# EAGLE design mixer_module (EAGLE 6.1)
AUTH: Jeremy Ruhland; LAST_DATE_TIME: 4/29/2014; VER: 1.0
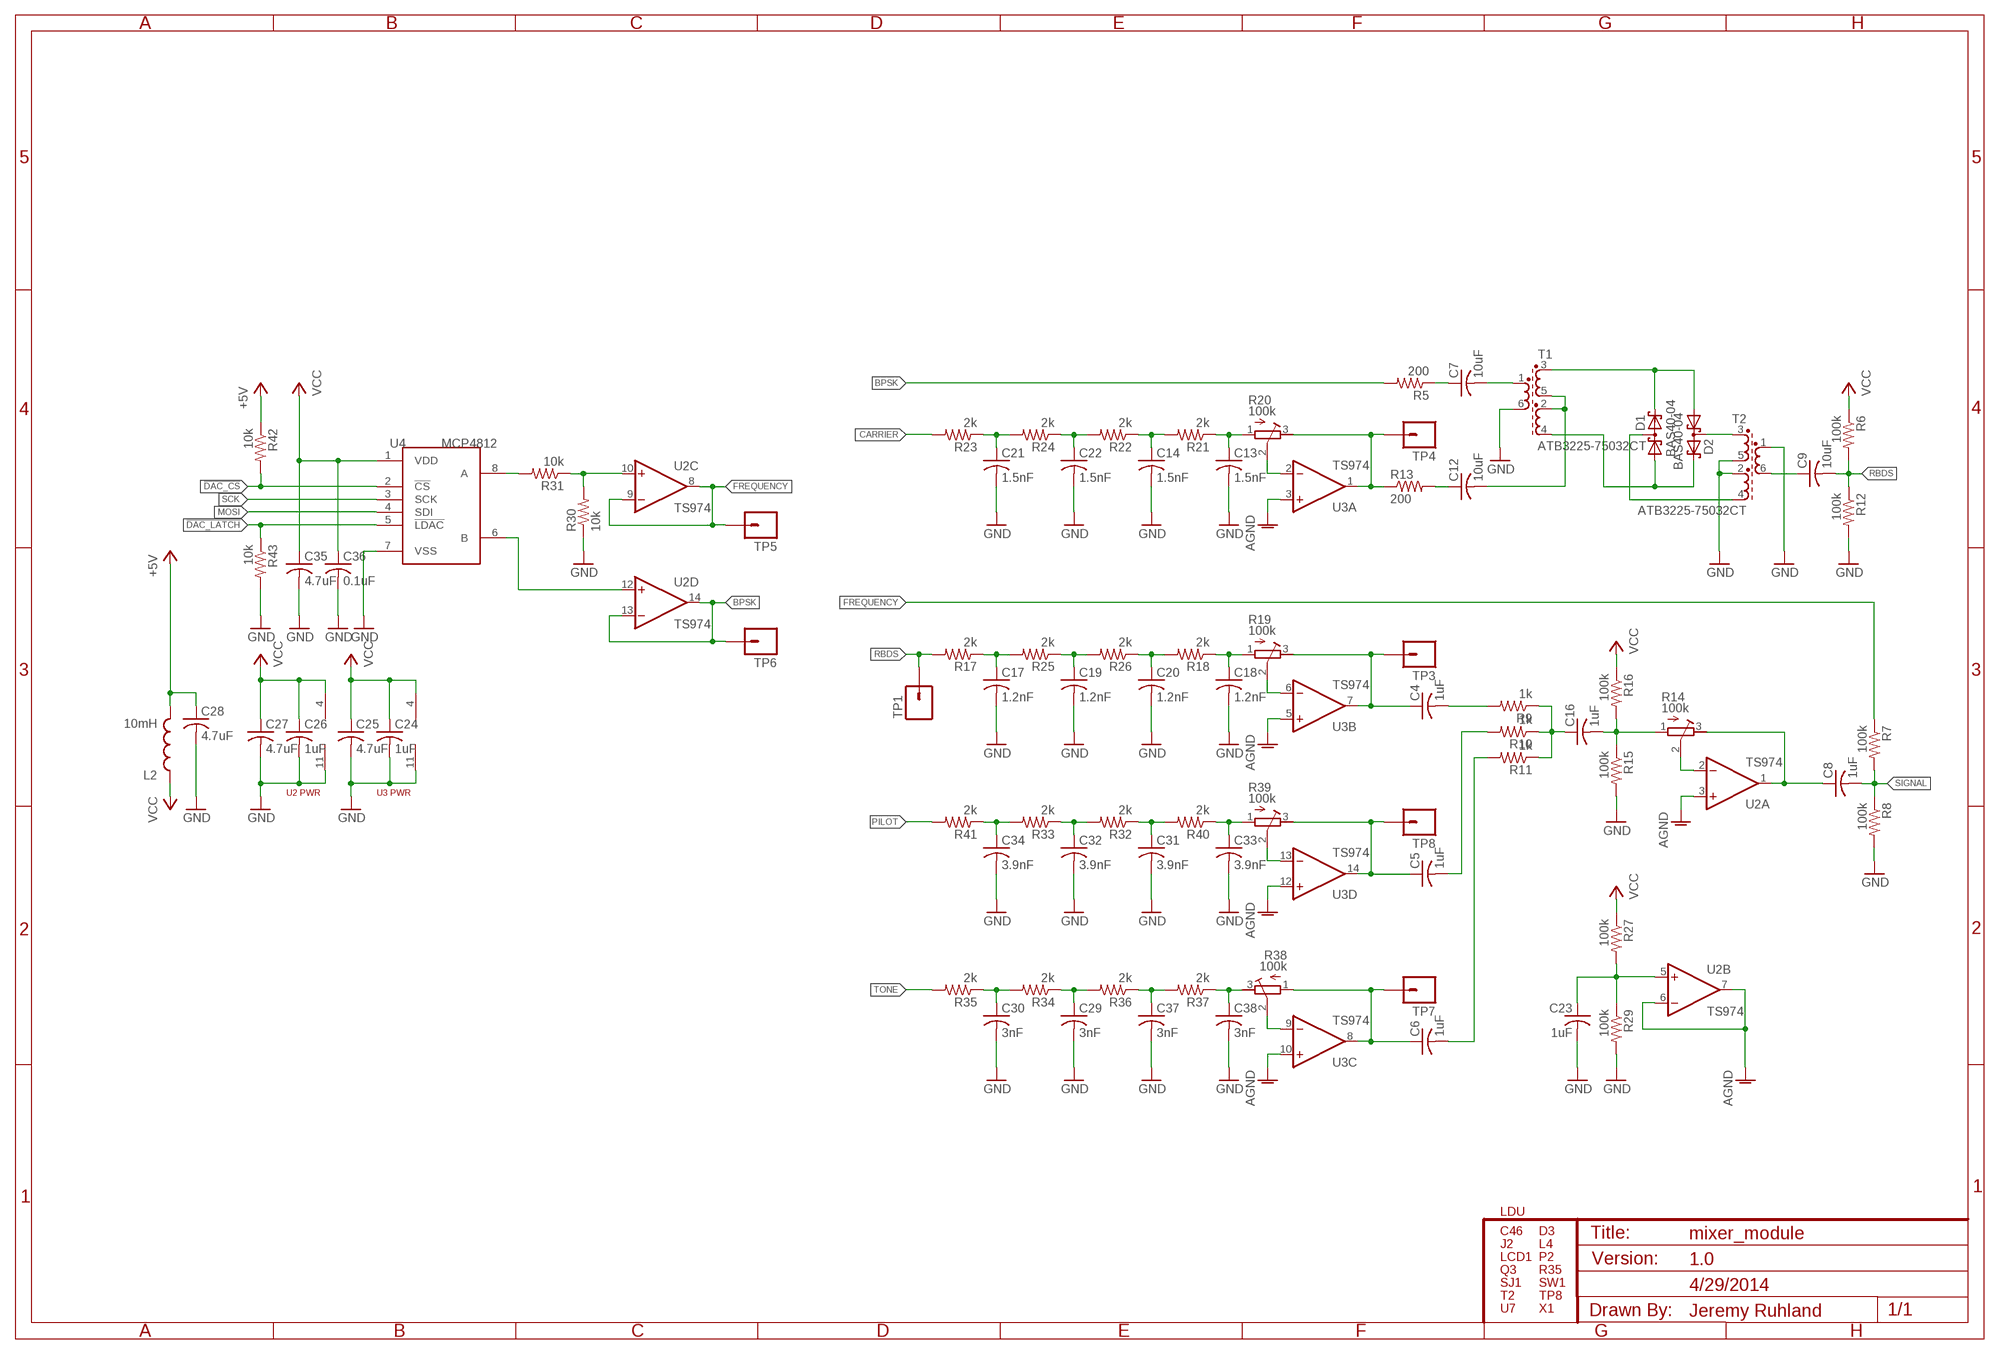
[diagram p0: schematic, sheet 1]

## Parts
C4  1uF  C-USC1206  [C1206]
C5  1uF  C-USC1206  [C1206]
C6  1uF  C-USC1206  [C1206]
C7  10uF  C-USC1206  [C1206]
C8  1uF  C-USC1206  [C1206]
C9  10uF  C-USC1206  [C1206]
C12  10uF  C-USC1206  [C1206]
C13  1.5nF  C-USC1206  [C1206]
C14  1.5nF  C-USC1206  [C1206]
C16  1uF  C-USC1206  [C1206]
C17  1.2nF  C-USC1206  [C1206]
C18  1.2nF  C-USC1206  [C1206]
C19  1.2nF  C-USC1206  [C1206]
C20  1.2nF  C-USC1206  [C1206]
C21  1.5nF  C-USC1206  [C1206]
C22  1.5nF  C-USC1206  [C1206]
C23  1uF  C-USC1206  [C1206]
C24  1uF  C-USC1206  [C1206]
C25  4.7uF  C-USC1206  [C1206]
C26  1uF  C-USC1206  [C1206]
C27  4.7uF  C-USC1206  [C1206]
C28  4.7uF  C-USC1206  [C1206]
C29  3nF  C-USC1206  [C1206]
C30  3nF  C-USC1206  [C1206]
C31  3.9nF  C-USC1206  [C1206]
C32  3.9nF  C-USC1206  [C1206]
C33  3.9nF  C-USC1206  [C1206]
C34  3.9nF  C-USC1206  [C1206]
C35  4.7uF  C-USC1206  [C1206]
C36  0.1uF  C-USC1206  [C1206]
C37  3nF  C-USC1206  [C1206]
C38  3nF  C-USC1206  [C1206]
D1  BAS40-04  [SOT23]
D2  BAS40-04  [SOT23]
L2  10mH  INDUCTOR1210  [1210]
R5  200  R-US_R1206  [R1206]
R6  100k  R-US_R1206  [R1206]
R7  100k  R-US_R1206  [R1206]
R8  100k  R-US_R1206  [R1206]
R9  1k  R-US_R1206  [R1206]
R10  1k  R-US_R1206  [R1206]
R11  1k  R-US_R1206  [R1206]
R12  100k  R-US_R1206  [R1206]
R13  200  R-US_R1206  [R1206]
R14  100k  R-TRIMM3304W  [RTRIM3304W]
R15  100k  R-US_R1206  [R1206]
R16  100k  R-US_R1206  [R1206]
R17  2k  R-US_R1206  [R1206]
R18  2k  R-US_R1206  [R1206]
R19  100k  R-TRIMM3304W  [RTRIM3304W]
R20  100k  R-TRIMM3304W  [RTRIM3304W]
R21  2k  R-US_R1206  [R1206]
R22  2k  R-US_R1206  [R1206]
R23  2k  R-US_R1206  [R1206]
R24  2k  R-US_R1206  [R1206]
R25  2k  R-US_R1206  [R1206]
R26  2k  R-US_R1206  [R1206]
R27  100k  R-US_R1206  [R1206]
R29  100k  R-US_R1206  [R1206]
R30  10k  R-US_R1206  [R1206]
R31  10k  R-US_R1206  [R1206]
R32  2k  R-US_R1206  [R1206]
R33  2k  R-US_R1206  [R1206]
R34  2k  R-US_R1206  [R1206]
R35  2k  R-US_R1206  [R1206]
R36  2k  R-US_R1206  [R1206]
R37  2k  R-US_R1206  [R1206]
R38  100k  R-TRIMM3304W  [RTRIM3304W]
R39  100k  R-TRIMM3304W  [RTRIM3304W]
R40  2k  R-US_R1206  [R1206]
R41  2k  R-US_R1206  [R1206]
R42  10k  R-US_R1206  [R1206]
R43  10k  R-US_R1206  [R1206]
T1  ATB3225-75032CT  [TRANS]
T2  ATB3225-75032CT  [TRANS]
TP1  M01PTH  [1X01]
TP3  M01PTH  [1X01]
TP4  M01PTH  [1X01]
TP5  M01PTH  [1X01]
TP6  M01PTH  [1X01]
TP7  M01PTH  [1X01]
TP8  M01PTH  [1X01]
U2  TS974  OPA4743UA  [SO14]
U3  TS974  OPA4743UA  [SO14]
U4  MCP4812  [SO-08]

## Nets
!DAC_CS: R42.2 U4.2(!CS)
!DAC_LATCH: R43.1 U4.5(!LDAC)
+5V: C28.1 L2.2 R42.1
AGND: U2.3(A:+IN) U2.6(B:-IN) U2.7(B:OUT) U3.3(A:+IN) U3.5(B:+IN) U3.10(C:+IN) U3.12(D:+IN)
BPSK: R5.2 TP6.1 U2.13(D:-IN) U2.14(D:OUT)
CARRIER: R23.2
FREQUENCY: R7.1 TP5.1 U2.8(C:OUT) U2.9(C:-IN)
GND: C13.2 C14.2 C17.2 C18.2 C19.2 C20.2 C21.2 C22.2 C23.2 C24.2 C25.2 C26.2 C27.2 C28.2 C29.2 C30.2 C31.2 C32.2 C33.2 C34.2 C35.2 C36.2 C37.2 C38.2 R8.2 R12.2 R15.2 R29.2 R30.1 R43.2 T1.6 T2.1 T2.2 T2.5 U2.11(P:V-) U3.11(P:V-) U4.7(VSS)
MOSI: U4.4(SDI)
N$1: C38.1 R37.1 R38.3(E)
N$3: D1.3(C1A2) T2.4
N$5: C16.2 R14.1(A) R15.1 R16.2
N$14: D2.3(C1A2) T2.3
N$16: D1.2(C2) D2.1(A1) T1.3
N$18: D1.1(A1) D2.2(C2) T1.4
N$19: C12.2 T1.2 T1.5
N$20: C7.2 T1.1
N$22: R14.2(S) U2.2(A:-IN)
N$23: C8.1 R14.3(E) U2.1(A:OUT)
N$25: C7.1 R5.1
N$26: C12.1 R13.2
N$27: R31.2 U4.8(A)
N$28: U2.12(D:+IN) U4.6(B)
N$42: C9.1 T2.6
N$46: R30.2 R31.1 U2.10(C:+IN)
N$55: C21.1 R23.1 R24.2
N$59: C22.1 R22.2 R24.1
N$60: C19.1 R25.1 R26.2
N$61: C20.1 R18.2 R26.1
N$62: C18.1 R18.1 R19.1(A)
N$63: C13.1 R20.1(A) R21.1
N$64: R19.2(S) U3.6(B:-IN)
N$65: C4.1 R19.3(E) TP3.1 U3.7(B:OUT)
N$66: C23.1 R27.2 R29.1 U2.5(B:+IN)
N$67: C32.1 R32.2 R33.1
N$68: C31.1 R32.1 R40.2
N$69: C33.1 R39.1(A) R40.1
N$70: R39.2(S) U3.13(D:-IN)
N$71: C5.1 R39.3(E) TP8.1 U3.14(D:OUT)
N$72: C29.1 R34.1 R36.2
N$73: C37.1 R36.1 R37.2
N$74: C6.1 R38.1(A) TP7.1 U3.8(C:OUT)
N$75: R38.2(S) U3.9(C:-IN)
N$77: R20.2(S) U3.2(A:-IN)
N$78: C4.2 R9.2
N$79: C5.2 R10.2
N$80: C6.2 R11.2
N$81: C16.1 R9.1 R10.1 R11.1
N$82: R13.1 R20.3(E) TP4.1 U3.1(A:OUT)
N$83: C17.1 R17.1 R25.2
N$84: C34.1 R33.2 R41.1
N$85: C30.1 R34.2 R35.1
N$86: C14.1 R21.2 R22.1
PILOT: R41.2
RBDS: C9.2 R6.2 R12.1 R17.2 TP1.1
SCK: U4.3(SCK)
SIGNAL: C8.2 R7.2 R8.1
TONE: R35.2
VCC: C24.1 C25.1 C26.1 C27.1 C35.1 C36.1 L2.1 R6.1 R16.1 R27.1 U2.4(P:V+) U3.4(P:V+) U4.1(VDD)

## Notes on the sheet
- U2 PWR | U3 PWR
- LDU
- C46 | D3
- J2 | L4
- LCD1 | P2
- Q3 | R35
- SJ1 | SW1
- T2 | TP8
- U7 | X1

## Library data of the parts
C4-C9 C12-C14 C16-C38 = adafruit:C-US: CAPACITOR, American symbol
D1 D2 = diode:BAS40-04: Silicon Schottky Diodes General-purpose diode for high-speed switching
L2 = sparkfun:INDUCTOR: Inductors Basic Inductor/Choke - 0603 and 1206. Footprints are not proven and vary greatly between part numbers.
R5-R13 R15-R18 R21-R27 R29-R37 R40-R43 = adafruit:R-US_: RESISTOR, American symbol
R14 R19 R20 R38 R39 = rcl:R-TRIMM: Trimm resistor
T1 T2 = tdk:ATB3225-75032CT
TP1 TP3-TP8 = sparkfun:M01: Header 1 Standard 1-pin 0.1" header. Use with straight break away headers (SKU : PRT-00116), right angle break away headers (PRT-00553), swiss pins (PRT-00743), machine pins (PRT-00117), and female headers (PRT-00115).
U2 U3 = linear:OPA4743: 12V, 7MHz, CMOS, Rail-to-Rail I/O Quad OP AMP Source: http://focus.ti.com/lit/ds/sbos201/sbos201.pdf
U4 = microchip:MCP4812

## Board
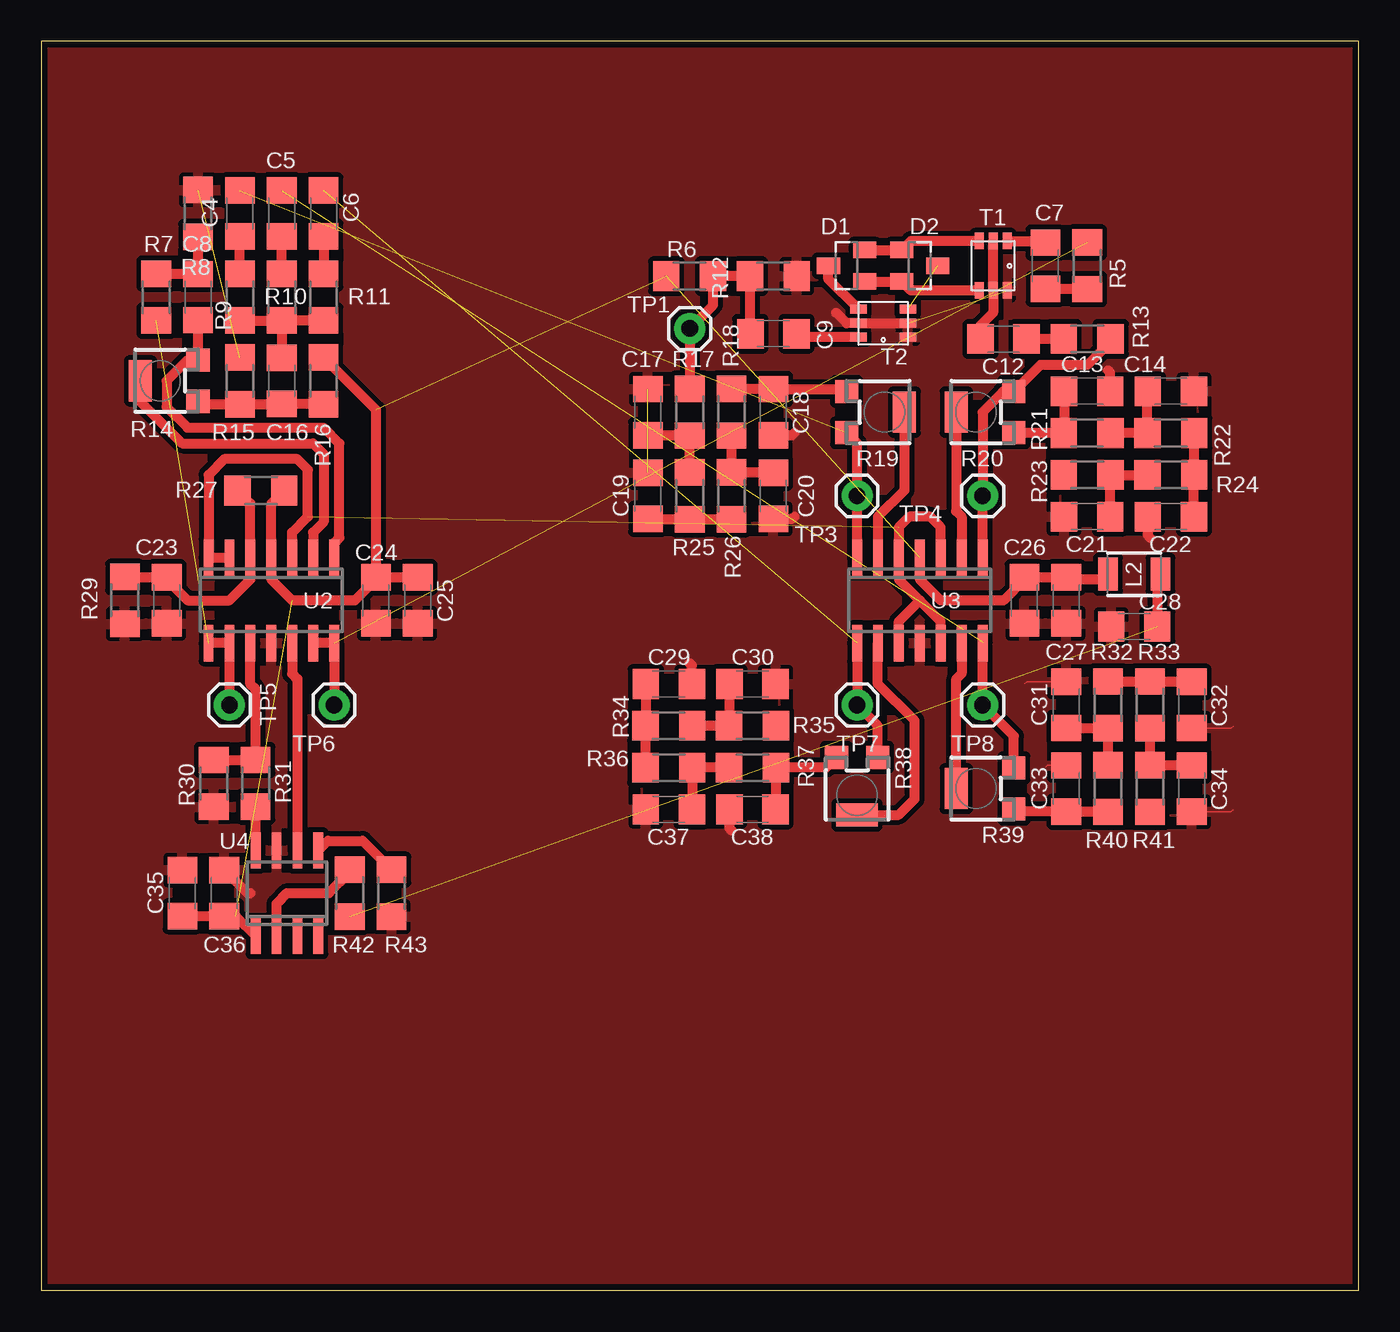
[diagram p1: board, top side]

Size 79.99 x 75.87 mm. Coordinates in mm from the lower left corner, seen from the top.
Outline: 0,0 79.99,0 79.99,75.87 0,75.87 0,0
Copper layers (1*16): Top 0.035559375mm / dielectric 1.501140625mm / Bottom 0.035559375mm
Design rules: minimum track width 10mil, minimum drill 15mil, track to track 6mil, track to pad 6mil, pad to pad 6mil, via to via 6mil, smd to smd 6mil, copper to edge 15mil, drill to drill 8mil, minimum pad ring 10mil, minimum via ring 8mil, stop-mask expansion 4mil, vias tented up to drill 0mil, thermal gap 10mil
tRestrict: area 61.9,29.2 to 70.2,36.5; area 36.8,28.9 to 44.5,37.1; area 36.5,47 to 44.8,54.6; area 62.2,46.7 to 69.8,54.9; area 11.4,53.7 to 17.8,67; area 18.4,22.5 to 21.6,25.7; area 8.3,22.5 to 11.4,25.7; area 10.8,40.3 to 17.8,43.5

### Footprints (pad centres in the part's own frame; a part is rotated, then mirrored left to right if it is on the bottom)
C1206 = smd 1.6 x 1.8: 1 -1.4,0; 2 1.4,0
SOT23 = smd 1 x 1.4: 1 -0.95,-1.1; 2 0.95,-1.1; 3 0,1.1
1210 = smd 1.2 x 2: 1 -1.6,0; 2 1.6,0
R1206 = smd 1.6 x 1.803: 1 -1.422,0; 2 1.422,0
RTRIM3304W = smd 1.4 x 1.4: 1 -1.25,-1.9; 3 1.25,-1.9 | smd 2.5 x 1.4: 2 0,1.6
TRANS = smd 1 x 0.55: 1 -1.5,0.85; 2 -1.5,0; 3 -1.5,-0.85; 4 1.5,-0.85; 5 1.5,0; 6 1.5,0.85
1X01 = drill 1.016 pad 1.88: 1 0,0
SO14 = smd 0.6 x 2.2: 1 -3.81,-2.6; 2 -2.54,-2.6; 3 -1.27,-2.6; 4 0,-2.6; 5 1.27,-2.6; 6 2.54,-2.6; 7 3.81,-2.6; 8 3.81,2.6; 9 2.54,2.6; 10 1.27,2.6; 11 0,2.6; 12 -1.27,2.6; 13 -2.54,2.6; 14 -3.81,2.6
SO-08 = smd 0.6 x 2.2: 1 -1.905,-2.6; 2 -0.635,-2.6; 3 0.635,-2.6; 4 1.905,-2.6; 5 1.905,2.6; 6 0.635,2.6; 7 -0.635,2.6; 8 -1.905,2.6

### Placement (x,y rotation side)
C4  12.06,65.41 270 top
C5  14.61,65.41 270 top
C6  17.14,65.41 270 top
C7  60.96,62.23 90 top
C8  9.53,60.33 90 top
C9  44.45,58.1 180 top
C12  58.42,57.78 180 top
C13  63.5,54.61 0 top
C14  68.58,54.61 0 top
C16  14.61,55.24 270 top
C17  36.83,53.34 90 top
C18  44.45,53.34 270 top
C19  36.83,48.26 90 top
C20  44.45,48.26 270 top
C21  63.5,46.99 180 top
C22  68.58,46.99 180 top
C23  7.62,41.91 270 top
C24  20.32,41.91 270 top
C25  22.86,41.91 270 top
C26  59.69,41.91 270 top
C27  62.23,41.91 270 top
C28  66.36,40.32 180 top
C29  38.1,36.83 0 top
C30  43.18,36.83 0 top
C31  62.23,35.56 90 top
C32  69.85,35.56 270 top
C33  62.23,30.48 90 top
C34  69.85,30.48 270 top
C35  8.57,24.13 90 top
C36  11.11,24.13 90 top
C37  38.1,29.21 180 top
C38  43.18,29.21 180 top
D1  48.9,62.23 90 top
D2  53.34,62.23 270 top
L2  66.36,43.5 0 top
R5  63.5,62.23 90 top
R6  39.37,61.59 0 top
R7  6.99,60.33 90 top
R8  9.53,65.41 90 top
R9  12.06,60.33 90 top
R10  14.61,60.33 90 top
R11  17.14,60.33 90 top
R12  44.45,61.59 0 top
R13  63.5,57.78 180 top
R14  7.62,55.24 90 top
R15  12.06,55.24 90 top
R16  17.14,55.24 270 top
R17  39.37,53.34 90 top
R18  41.91,53.34 270 top
R19  50.8,53.34 270 top
R20  57.15,53.34 90 top
R21  63.5,52.07 0 top
R22  68.58,52.07 0 top
R23  63.5,49.53 180 top
R24  68.58,49.53 180 top
R25  39.37,48.26 90 top
R26  41.91,48.26 270 top
R27  13.34,48.58 180 top
R29  5.08,41.91 270 top
R30  10.48,30.8 90 top
R31  13.02,30.8 270 top
R32  64.77,35.56 90 top
R33  67.31,35.56 270 top
R34  38.1,34.29 0 top
R35  43.18,34.29 0 top
R36  38.1,31.75 180 top
R37  43.18,31.75 180 top
R38  49.53,30.48 180 top
R39  57.15,30.48 90 top
R40  64.77,30.48 90 top
R41  67.31,30.48 270 top
R42  18.73,24.13 90 top
R43  21.27,24.13 270 top
T1  57.78,62.23 270 top
T2  51.12,58.74 180 top
TP1  39.37,58.42 180 top
TP3  49.53,48.26 180 top
TP4  57.15,48.26 180 top
TP5  11.43,35.56 180 top
TP6  17.78,35.56 180 top
TP7  49.53,35.56 180 top
TP8  57.15,35.56 180 top
U2  13.97,41.91 180 top
U3  53.34,41.91 180 top
U4  14.92,24.13 0 top

### Tracks (layer width: path | path; a pad name or v marks a point on that pad's centre or on a via)
!DAC_CS
  Top 0.61: U4.2 14.29,23.5 14.92,24.13 17.46,24.13 18.73,25.4 R42.2
!DAC_LATCH
  Top 0.61: U4.5 17.4,27.3 19.52,27.3 R43.1
+5V  (1 unrouted)
  Top 0.61: L2.2 67.76,43.3 C28.1
AGND  (1 unrouted)
  Top 0.61: U3.3 54.61,46.35 53.98,46.99 52.7,46.99 52.07,46.35 U3.5 52.07,43.18 53.34,41.91 | U2.6 U2.7 10.16,49.53 11.11,50.48 15.56,50.48 16.19,49.85 16.19,46.99 15.24,46.04 U2.3 | U3.12 54.61,40.64 53.34,41.91 | U3.10 52.07,40.64 53.34,41.91
BPSK  (1 unrouted)
  Top 0.61: U2.13 16.51,39.37 16.57,39.31 U2.14 TP6.1
FREQUENCY  (1 unrouted)
  Top 0.61: U2.8 U2.9 TP5.1
GND  (3 unrouted)
  Top 0: C31.2 59.82,36.96 59.69,36.83 | C33.2 61.09,31.88 60.96,31.75 | C32.2 72.26,34.16 72.39,34.29 | C34.2 72.26,29.08 72.39,29.21
  Top 0.61: 48.26,59.37 48.9,58.74 T2.5 T2.2 | C13.2 64.9,55.75 64.77,55.88 | C22.2 67.18,45.85 67.31,45.72 | C38.2 41.78,28.07 41.91,27.94 | C29.2 39.5,37.97 39.37,38.1 | C20.2 45.59,46.86 45.72,46.99 | C18.2 45.59,51.94 45.72,52.07 | C36.2 12.51,24.13 12.7,24.13
  pour Top (isolate 0.305): 0,0 0,76.2 80.01,76.2 80.01,0
N$1
  Top 0.61: C38.1 44.45,29.21 44.6,29.36 R37.1 47.65,31.75 R38.3
N$3
  Top 0.61: T2.4 47.8,61.41 D1.3
N$5
  Top 0.61: R16.2 14.76,53.82 14.61,53.98 C16.2 14.58,53.82 R15.1 9.52,53.82 R14.1
N$14  (1 unrouted)
N$16
  Top 0.61: D1.2 D2.1 52.79,63.73 T1.3
N$18
  Top 0.61: D1.1 D2.2 52.79,60.73 T1.4
N$19
  Top 0.61: T1.2 T1.5 57.78,59.37 57.02,58.61 C12.2
N$20
  Top 0.61: T1.1 60.96,63.73 C7.2
N$22
  Top 0.61: R14.2 6.02,53.99 8.57,51.44 16.51,51.44 17.14,50.8 17.14,46.67 16.51,46.04 U2.2
N$23
  Top 0.61: U2.1 17.78,45.4 18.1,45.72 18.1,51.44 17.14,52.39 8.89,52.39 7.62,53.66 7.62,55.24 8.87,56.49 R14.3 C8.1
N$25
  Top 0.61: R5.1 61.11,60.81 60.96,60.96 C7.1
N$26
  Top 0.61: R13.2 C12.1
N$27
  Top 0.61: U4.8 13.02,28.89 12.7,29.21 12.87,29.38 R31.2
N$28
  Top 0.61: U2.12 15.24,37.47 15.56,37.15 U4.6
N$42
  Top 0.61: T2.6 46.06,57.89 C9.1
N$46
  Top 0.61: R30.2 R31.1 13.02,36.51 12.7,36.83 U2.10
N$55
  Top 0.61: C21.1 64.9,49.51 R23.1 R24.2
N$59
  Top 0.61: C22.1 69.98,49.51 R24.1 R22.2
N$60
  Top 0.61: C19.1 39.35,46.86 R25.1 R26.2
N$61
  Top 0.61: C20.1 41.93,49.66 R26.1 R18.2
N$62
  Top 0.61: R18.1 41.93,54.74 C18.1 48.75,54.74 R19.1
N$63
  Top 0.61: C13.1 62.1,52.09 R21.1 59.07,52.07 R20.1
N$64
  Top 0.61: R19.2 52.4,48.59 50.8,46.99 U3.6
N$65  (1 unrouted)
  Top 0.61: U3.7 TP3.1 49.53,51.46 R19.3
N$66
  Top 0.61: R27.2 12.7,47.79 U2.5 12.7,43.18 11.43,41.91 8.89,41.91 7.62,43.18 C23.1 7.6,43.33 R29.1
N$67
  Top 0.61: R32.2 R33.1 69.83,36.98 C32.1
N$68
  Top 0.61: R40.2 R32.1 62.25,34.14 C31.1
N$69
  Top 0.61: R40.1 64.75,29.08 C33.1 59.2,29.08 R39.1
N$70
  Top 0.61: U3.13 55.88,37.47 55.56,37.15 55.56,30.49 R39.2
N$71  (1 unrouted)
  Top 0.61: R39.3 59.05,33.66 TP8.1 U3.14 57.15,39.37
N$72
  Top 0.61: C29.1 36.7,34.31 R34.1 R36.2
N$73
  Top 0.61: R37.2 R36.1 39.52,29.23 C37.1
N$74  (1 unrouted)
  Top 0.61: U3.8 TP7.1 50.78,34.31 R38.1
N$75
  Top 0.61: 50.8,39.37 U3.9 50.8,36.83 53.02,34.61 53.02,29.84 52.06,28.88 R38.2
N$77
  Top 0.61: R20.2 55.55,47.32 55.88,46.99 U3.2
N$78
  Top 0.61: R9.2 C4.2
N$79
  Top 0.61: R10.2 C5.2
N$80
  Top 0.61: C6.2 R11.2 17.14,61.59
N$81
  Top 0.61: R11.1 R10.1 | R9.1 R10.1 | R10.1 C16.1
N$82
  Top 0.61: U3.1 TP4.1 57.15,53.34 58.4,54.59 R20.3 60.66,56.2 63.5,56.2 64.92,57.62 R13.1
N$83
  Top 0.61: R25.2 R17.1 36.85,51.92 C17.1
N$84
  Top 0.61: R33.2 R41.1 69.83,31.9 C34.1
N$85
  Top 0.61: C30.1 41.78,34.31 R35.1 R34.2
N$86
  Top 0.61: R21.2 R22.1 67.16,54.59 C14.1
RBDS
  Top 0.61: 39.37,54.61 R17.2 TP1.1 40.79,59.84 R6.2 R12.1 43.05,61.57 C9.2
SIGNAL
  Top 0.61: R7.2 9.5,61.75 | 9.5,61.75 C8.2 | 9.5,61.75 9.53,61.77 R8.1
VCC  (3 unrouted)
  Top 0.61: C25.1 C24.1 | C24.1 20.32,43.18 19.05,41.91 15.24,41.91 13.97,43.18 U2.4 13.97,47.79 R27.1 | U3.4 53.34,43.18 54.61,41.91 58.42,41.91 59.69,43.18 C26.1 C27.1 62.23,43.18 64.44,43.18 L2.1 | C35.1 C36.1 11.82,22.73 U4.1 | R16.1 20.32,53.49 C24.1